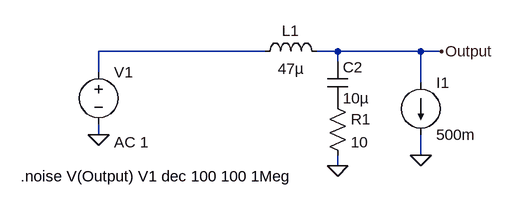
[diagram p0: schematic LC-Filter.asc]
LC-Filter.asc, the LTspice schematic file:
Version 4
SHEET 1 880 680
WIRE 256 128 0 128
WIRE 368 128 336 128
WIRE 496 128 368 128
WIRE 528 128 496 128
WIRE 368 144 368 128
WIRE 0 160 0 128
WIRE 496 176 496 128
WIRE 0 256 0 240
WIRE 496 288 496 256
WIRE 368 304 368 288
FLAG 0 256 0
FLAG 528 128 Output
FLAG 368 304 0
FLAG 496 288 0
SYMBOL voltage 0 144 R0
WINDOW 123 24 124 Left 2
WINDOW 39 0 0 Left 0
SYMATTR Value2 AC 1
SYMATTR InstName V1
SYMATTR Value ""
SYMBOL cap 352 144 R0
SYMATTR InstName C2
SYMATTR Value 10µ
SYMATTR SpiceLine Rser=1
SYMBOL ind 240 144 R270
WINDOW 0 32 56 VTop 2
WINDOW 3 5 56 VBottom 2
SYMATTR InstName L1
SYMATTR Value 47µ
SYMBOL res 352 192 R0
SYMATTR InstName R1
SYMATTR Value 10
SYMBOL current 496 176 R0
WINDOW 123 0 0 Left 0
WINDOW 39 0 0 Left 0
SYMATTR InstName I1
SYMATTR Value 500m
TEXT -120 320 Left 2 !.noise V(Output) V1 dec 100 100 1Meg

The netlist it stands for:
* LC-Filter.asc
V1 N001 0 AC 1
C2 Output P001 10µ Rser=1
L1 N001 Output 47µ
R1 P001 0 10
I1 Output 0 500m
.noise V(Output) V1 dec 100 100 1Meg
.backanno
.end